# EAGLE design Motor_Sürücü (EAGLE 9.6.2)
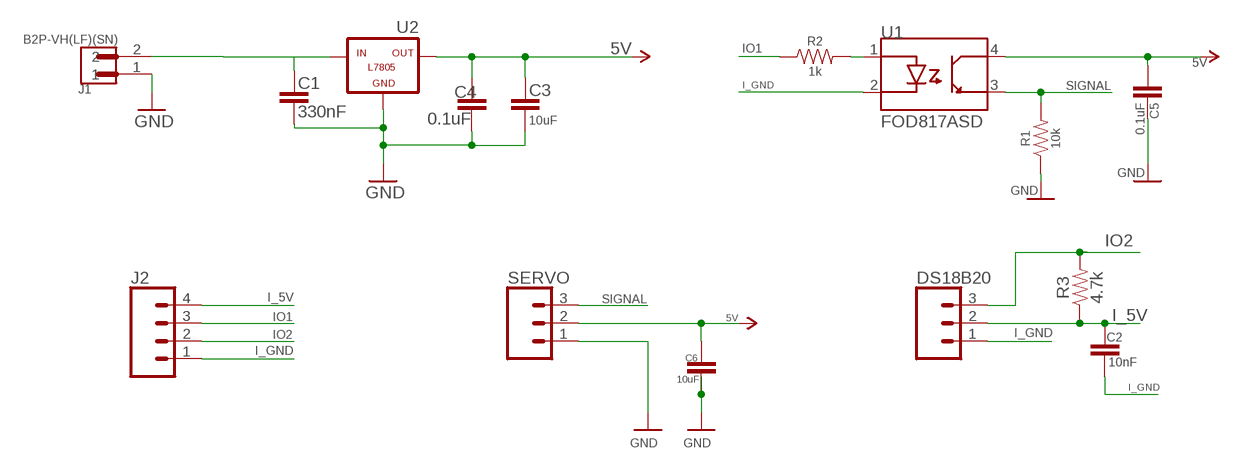
[diagram p0: schematic, sheet 1]

## Parts
C1  330nF  0.1UF-0603-25V-(+80/-20%)  [0603]
C2  10nF  0.1UF-0603-25V-(+80/-20%)  [0603]
C3  10uF  0.1UF-0603-25V-(+80/-20%)  [0603]
C4  0.1uF  0.1UF-0603-25V-(+80/-20%)  [0603]
C5  0.1uF  0.1UF-0603-25V-(+80/-20%)  [0603]
C6  10uF  0.1UF-0603-25V-(+80/-20%)  [0603]
DS18B20  CONN_03  [1X03]
J1  B2P-VH(LF)(SN)  [JST_B2P-VH(LF)(SN)]
J2  CONN_04  [1X04]
R1  10k  4.7KOHM-0603-1/10W-1%  [0603]
R2  1k  4.7KOHM-0603-1/10W-1%  [0603]
R3  4.7k  4.7KOHM-0603-1/10W-1%  [0603]
SERVO  CONN_03  [1X03]
U1  FOD817ASD  [SOIC254P1016X385-4N]
U2  L7805  [78XXL]

## Nets
5V: C3.1 C4.1 C5.2 C6.1 SERVO.2 U1.4(COLLECTOR) U2.OUT
GND: C1.2 C3.2 C4.2 C5.1 C6.2 J1.1 R1.1 SERVO.1 U2.GND
I_5V: C2.1 DS18B20.2 J2.4 R3.1
I_GND: C2.2 DS18B20.1 J2.1 U1.2(CATHODE)
IO1: J2.3 R2.1
IO2: DS18B20.3 J2.2 R3.2
N$1: R2.2 U1.1(ANODE)
N$4: C1.1 J1.2 U2.IN
SIGNAL: R1.2 SERVO.3 U1.3(EMITTER)

## Library data of the parts
C1-C3 C6 = SparkFun-Capacitors:0.1UF: 0.1µF ceramic capacitors A capacitor is a passive two-terminal electrical component used to store electrical energy temporarily in an electric field.; PROD_ID: CAP-00810; VALUE: 0.1uF
C4 C5 = SparkFun-Capacitors:0.1UF: 0.1µF ceramic capacitors A capacitor is a passive two-terminal electrical component used to store electrical energy temporarily in an electric field.; PROD_ID: CAP-00810
DS18B20 SERVO = SparkFun-Connectors:CONN_03: Multi connection point. Often used as Generic Header-pin footprint for 0.1 inch spaced/style header connections On any of the 0.1 inch spaced packages, you can populate with these: Break Away Headers - Straight <https://www.sparkfun.com/products/116> (PRT-00116) Break Away Male Headers - Right Angle <https://www.sparkfun.com/products/553> (PRT-00553) Female Headers <https://www.sparkfun.com/products/115> (PRT-00115) Break Away Headers - Machine Pin <https://www.sparkfun.com/products/117> (PRT-00117) Break Away Female Headers - Swiss Machine Pin <https://www.sparkfun.com/products/743> (PRT-00743) Stackable Header - 3 Pin (Female, 0.1") <https://www.sparkfun.com/products/13875> (PRT-13875) For SCREWTERMINALS and SPRING TERMINALS visit here: Screw Terimnals on SparkFun.com <https://www.sparkfun.com/search/results?term=Screw+Terminals> (5mm/3.5mm/2.54mm spacing) This device is also useful as a general connection point to wire up your design to another part of your project. Our various solder wires solder well into these plated through hole pads. Hook-Up Wire - Assortment (Stranded, 22 AWG) <https://www.sparkfun.com/products/11375> (PRT-11375) Hook-Up Wire - Assortment (Solid Core, 22 AWG) <https://www.sparkfun.com/products/11367> (PRT-11367) View the entire wire category on our website here <https://www.sparkfun.com/categories/141> Special notes: Molex polarized connector foot print use with SKU : PRT-08232 with associated crimp pins and housings.
J1 = B2P-VH_LF__SN_:B2P-VH(LF)(SN): VH Series 3.96 mm Pitch, Compact, Lock Mechanism also Prevents Misinsertion Check prices <https://pricing.snapeda.com/parts/B2P-VH%28LF%29%28SN%29/JST%20Sales/view-part?ref=eda>; AVAILABILITY: Bad; DESCRIPTION: Connector Header Through Hole 2 position 0.156 (3.96mm); MF: JST Sales; MP: B2P-VH(LF)(SN); PACKAGE: None; PRICE: None
J2 = SparkFun-Connectors:CONN_04: Multi connection point. Often used as Generic Header-pin footprint for 0.1 inch spaced/style header connections On any of the 0.1 inch spaced packages, you can populate with these: Break Away Headers - Straight <https://www.sparkfun.com/products/116> (PRT-00116) Break Away Male Headers - Right Angle <https://www.sparkfun.com/products/553> (PRT-00553) Female Headers <https://www.sparkfun.com/products/115> (PRT-00115) Break Away Headers - Machine Pin <https://www.sparkfun.com/products/117> (PRT-00117) Break Away Female Headers - Swiss Machine Pin <https://www.sparkfun.com/products/743> (PRT-00743) For SCREWTERMINALS and SPRING TERMINALS visit here: Screw Terimnals on SparkFun.com <https://www.sparkfun.com/search/results?term=Screw+Terminals> (5mm/3.5mm/2.54mm spacing) This device is also useful as a general connection point to wire up your design to another part of your project. Our various solder wires solder well into these plated through hole pads. Hook-Up Wire - Assortment (Stranded, 22 AWG) <https://www.sparkfun.com/products/11375> (PRT-11375) Hook-Up Wire - Assortment (Solid Core, 22 AWG) <https://www.sparkfun.com/products/11367> (PRT-11367) View the entire wire category on our website here <https://www.sparkfun.com/categories/141> Special notes: Molex polarized connector foot print use with SKU : PRT-08231 with associated crimp pins and housings. 1MM SMD Version SKU: PRT-10208; PROD_ID: CONN-09696
R1 R2 = SparkFun-Resistors:4.7KOHM: 4.7kΩ resistor A resistor is a passive two-terminal electrical component that implements electrical resistance as a circuit element. Resistors act to reduce current flow, and, at the same time, act to lower voltage levels within circuits. - Wikipedia; PROD_ID: RES-07857; VALUE: 4.7k
R3 = SparkFun-Resistors:4.7KOHM: 4.7kΩ resistor A resistor is a passive two-terminal electrical component that implements electrical resistance as a circuit element. Resistors act to reduce current flow, and, at the same time, act to lower voltage levels within circuits. - Wikipedia; PROD_ID: RES-07857
U1 = FOD817ASD:FOD817ASD: DIP4 Surface Mount Single Channel 70 V 5000 Vrms Phototransistor Optocoupler Check prices <https://pricing.snapeda.com/parts/FOD817ASD/ON%20Semiconductor/view-part?ref=eda>; AVAILABILITY: Warning; DESCRIPTION: Optoisolator Transistor Output 5000Vrms 1 Channel 4-SMD; MF: ON Semiconductor; MP: FOD817ASD; PACKAGE: PDIP GW-4 ON Semiconductor; PRICE: None; PURCHASE-URL: https://pricing.snapeda.com/search/part/FOD817ASD/?ref=eda
U2 = tango:L7805: VOLTAGE REGULATOR

## Board
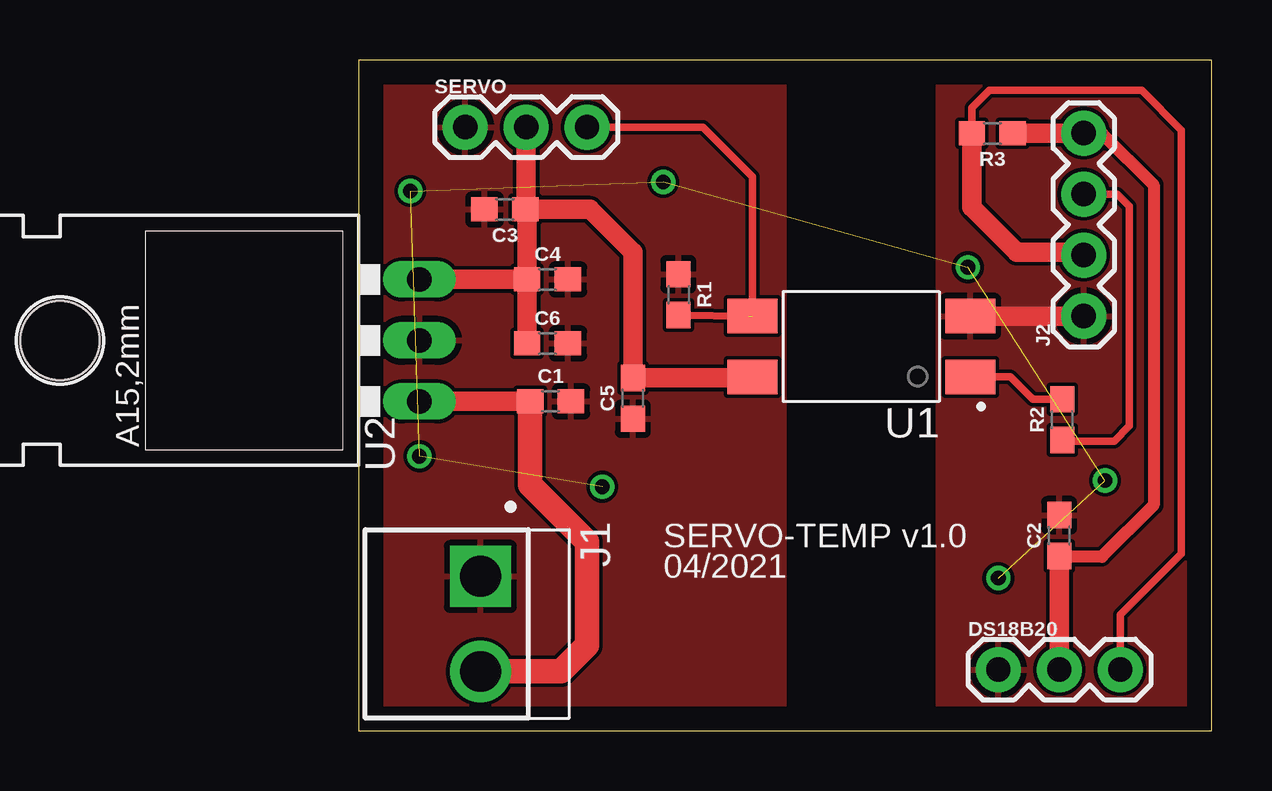
[diagram p1: board, top side]
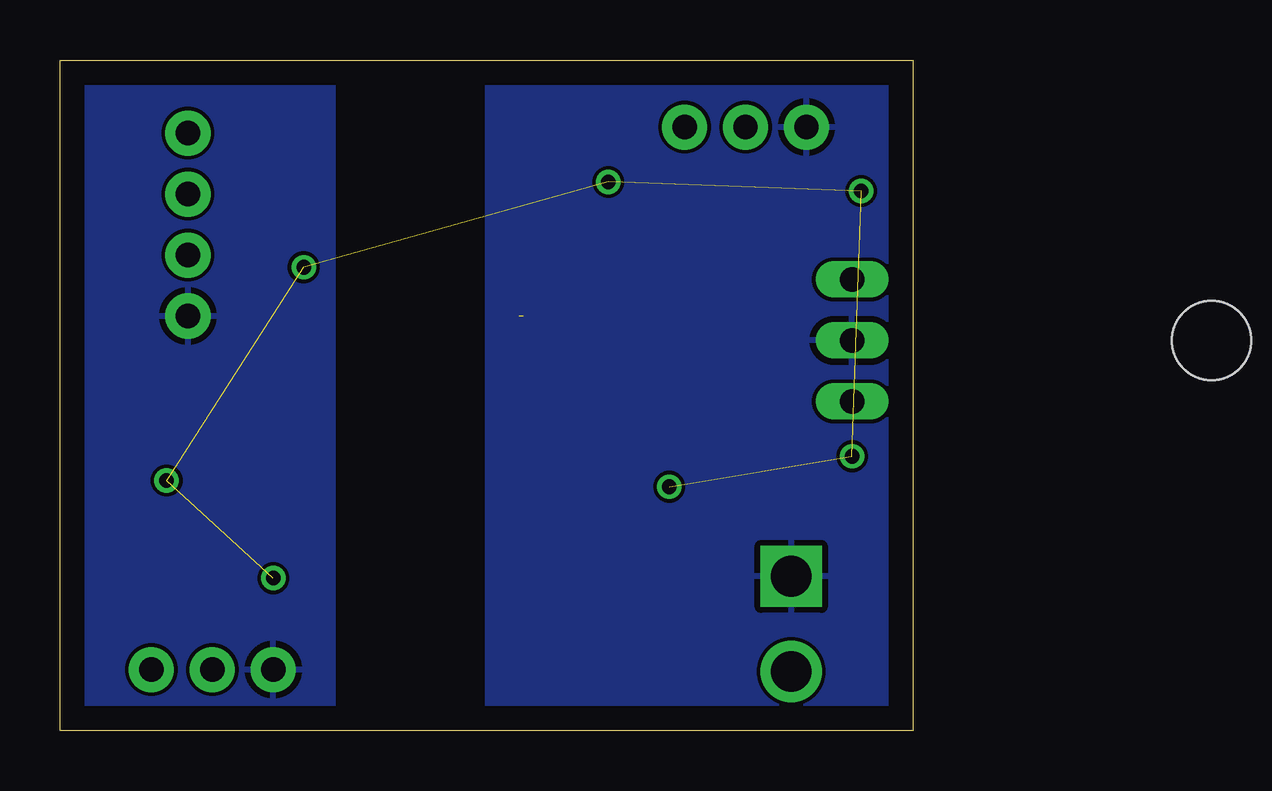
[diagram p2: board, bottom side, seen from below]

Size 35.56 x 27.94 mm. Coordinates in mm from the lower left corner, seen from the top.
Outline: 0,0 35.56,0 35.56,27.94 0,27.94 0,0
Copper layers (1*16): Top 0.035mm / dielectric 1.5mm / Bottom 0.035mm
Design rules "default": minimum track width 6mil, minimum drill 0.35mm, track to track 6mil, track to pad 6mil, pad to pad 6mil, via to via 6mil, smd to smd 6mil, copper to edge 40mil, drill to drill 6mil, minimum pad ring 10mil, minimum via ring 8mil, stop-mask expansion 4mil, vias tented up to drill 0mil, thermal gap 10mil

### Footprints (pad centres in the part's own frame; a part is rotated, then mirrored left to right if it is on the bottom)
0603 = smd 1.1 x 1: 1 -0.85,0; 2 0.85,0
1X03 = drill 1.016 pad 1.88: 1 0,0; 2 2.54,0; 3 5.08,0
JST_B2P-VH(LF)(SN) = drill 1.7 square: 1 -1.98,0 | drill 1.7: 2 1.98,0
1X04 = drill 1.016 pad 1.88: 1 0,0; 2 2.54,0; 3 5.08,0; 4 7.62,0
SOIC254P1016X385-4N = smd 2.09 x 1.44: 1 -4.54,1.27; 2 -4.54,-1.27; 3 4.54,-1.27; 4 4.54,1.27
78XXL = drill 1.016 long: GND 0,-3.81; IN -2.54,-3.81; OUT 2.54,-3.81 | hole 3.302: 0,11.176

### Placement (x,y rotation side)
C1  8,13.72 0 top
C2  29.21,8.13 90 top
C3  6.1,21.72 180 top
C4  7.87,18.8 0 top
C5  11.43,13.84 90 top
C6  7.87,16.13 0 top
DS18B20  26.67,2.54 0 top
J1  5.08,4.45 270 top
J2  30.23,17.27 90 top
R1  13.33,18.16 270 top
R2  29.34,12.95 90 top
R3  26.42,24.89 180 top
SERVO  4.45,25.15 0 top
U1  20.96,16 180 top
U2  -1.27,16.26 90 top

### Tracks (layer width: path | path; a pad name or v marks a point on that pad's centre or on a via)
5V
  Top 0.813: U2.OUT C4.1 | U1.4 16.38,14.69 C5.2 11.43,19.94 9.65,21.72 C3.1 | C4.1 C6.1 | SERVO.2 6.98,21.76 C3.1 | C3.1 7.02,21.64 C4.1
GND
  pour Top: 17.78,29.21 17.78,-1.27 -6.35,-1.27 -6.35,29.21
  pour Bottom: -5.08,29.21 17.78,29.21 17.78,-1.27 -5.08,-1.27
I_5V
  Top 0.508: J2.4 30.99,24.89 33.15,22.73 33.15,9.4 30.99,7.24 29.21,7.24
  Top 0.813: J2.4 R3.1 | C2.1 29.21,7.24 DS18B20.2
I_GND
  Top 0.813: U1.2 J2.1
  pour Top: 24.13,29.21 24.13,-1.27 38.1,-1.27 38.1,29.21
  pour Bottom: 24.13,29.21 36.83,29.21 36.83,-1.27 24.13,-1.27
IO1
  Top 0.305: J2.3 31.62,22.35 32.13,21.84 32.13,12.7 31.5,12.06 29.38,12.06 R2.1
IO2
  Top 0.305: R3.2 25.57,25.95 26.29,26.67 32.64,26.67 34.29,25.02 34.29,7.37 31.75,4.83 DS18B20.3
  Top 0.813: R3.2 25.57,21.8 27.43,19.94 30.1,19.94 J2.2
N$1
  Top 0.305: U1.1 27.18,14.73 28.11,13.8 R2.2
N$2  (via drill 0.61)  (6 unrouted)
  other vias: 2.54,11.43 10.16,10.16 2.16,22.48 12.7,22.86 26.67,6.35 25.4,19.3 31.11,10.41
N$4
  Top 0.813: U2.IN C1.1
  Top 1.016: J1.2 8.43,2.46 9.53,3.56 9.53,7.87 7.15,10.25 C1.1 7.11,13.68
SIGNAL  (1 unrouted)
  Top 0.305: R1.2 16.26,17.27 | U1.3 16.42,23.08 14.35,25.15 SERVO.3

### Text on the board
tPlace: SERVO-TEMP v1.0 | 04/2021